# EAGLE design aasdasd (EAGLE 9.0.1)
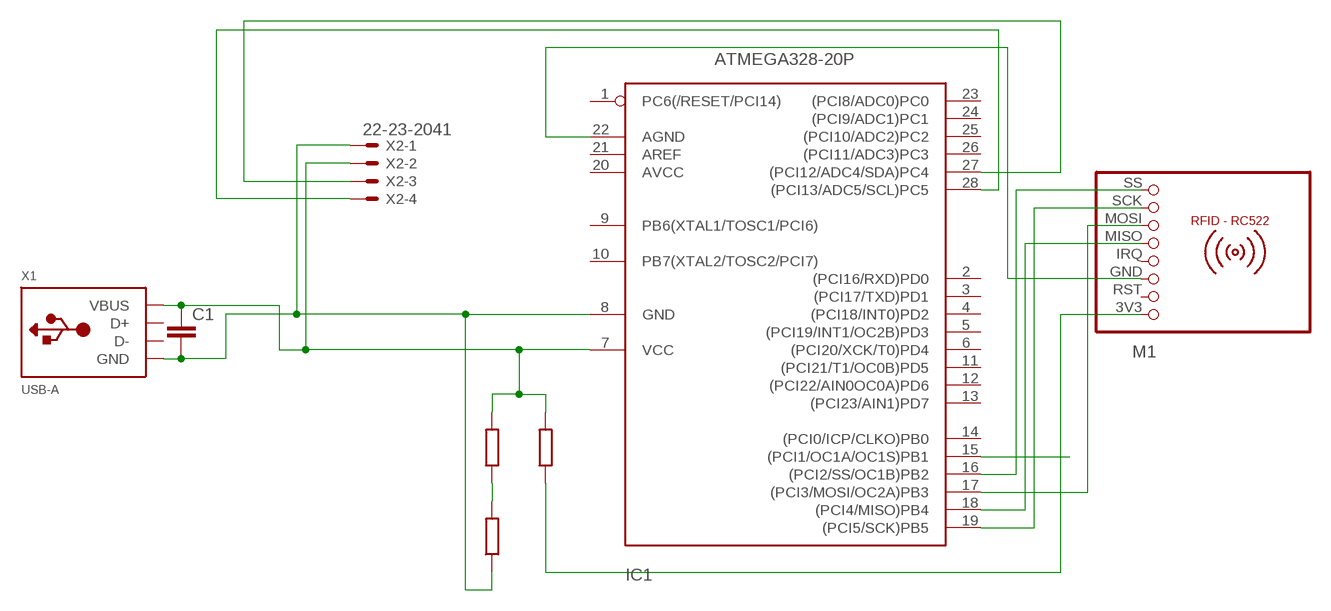
[diagram p0: schematic, sheet 1]

## Parts
C1  C-EU025-050X050  [C025-050X050]
IC1  ATMEGA328-20P  [DIL28-3]
M1  RFID-RC522  [RFID-RC522]
X1  USB-A  [MOLEX_480371000]
X2  22-23-2041  [22-23-2041]

## Nets
N$2: C1.2 IC1.8(GND) X1.4(GND) X2.1
N$3: M1.3V3
N$4: IC1.19((PCI5/SCK)PB5) M1.SCK
N$5: IC1.18((PCI4/MISO)PB4) M1.MISO
N$7: IC1.22(AGND) M1.GND
N$8: IC1.16((PCI2/SS/OC1B)PB2) M1.SS
N$9: IC1.17((PCI3/MOSI/OC2A)PB3) M1.MOSI
N$10: IC1.15((PCI1/OC1A/OC1S)PB1)
N$12: IC1.27((PCI12/ADC4/SDA)PC4) X2.3
N$13: IC1.28((PCI13/ADC5/SCL)PC5) X2.4
N$14: C1.1 IC1.7(VCC) X1.1(VBUS) X2.2
Unconnected: IC1.1(PC6(/RESET/PCI14)) IC1.2((PCI16/RXD)PD0) IC1.3((PCI17/TXD)PD1) IC1.4((PCI18/INT0)PD2) IC1.5((PCI19/INT1/OC2B)PD3) IC1.6((PCI20/XCK/T0)PD4) IC1.9(PB6(XTAL1/TOSC1/PCI6)) IC1.10(PB7(XTAL2/TOSC2/PCI7)) IC1.11((PCI21/T1/OC0B)PD5) IC1.12((PCI22/AIN0OC0A)PD6) IC1.13((PCI23/AIN1)PD7) IC1.14((PCI0/ICP/CLKO)PB0) IC1.20(AVCC) IC1.21(AREF) IC1.23((PCI8/ADC0)PC0) IC1.24((PCI9/ADC1)PC1) IC1.25((PCI10/ADC2)PC2) IC1.26((PCI11/ADC3)PC3) M1.IRQ M1.RST X1.2(D-) X1.3(D+)

## Library data of the parts
C1 = rcl:C-EU: CAPACITOR, European symbol; SPICEPREFIX: C
IC1 = atmega328:ATMEGA328*P: MICROCONTROLLER 32 kBytes FLASH 2 kBytes SRAM 1 kBytes EEPROM USART 8-channel 10 bit ADC
M1 = mfrc522-module:RFID-RC522: RFID-RC522 MFRC-522 based breakout board
X1 = adafruit:USB-A: USB type A 'plug' Used for things that can directly connect to a USB port, say USB key
X2 = con-molex:22-23-2041: .100" (2.54mm) Center Header - 4 Pin; MF: MOLEX; MPN: 22-23-2041; OC_FARNELL: 1462920; OC_NEWARK: 38C0355

## Board
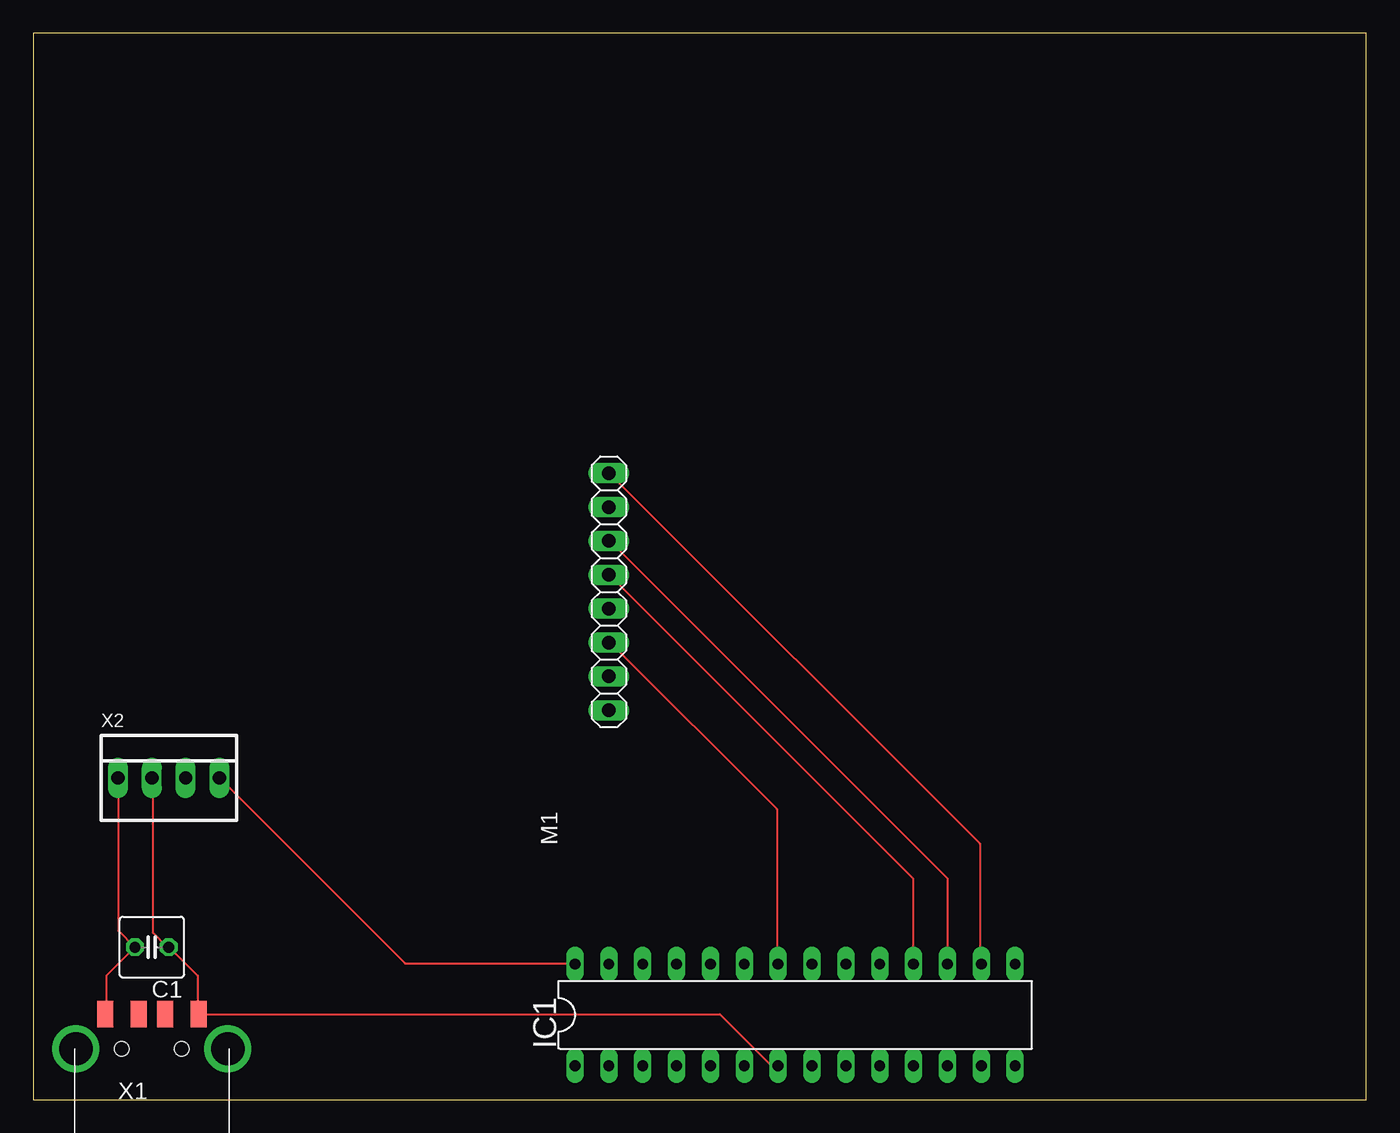
[diagram p1: board, top side]
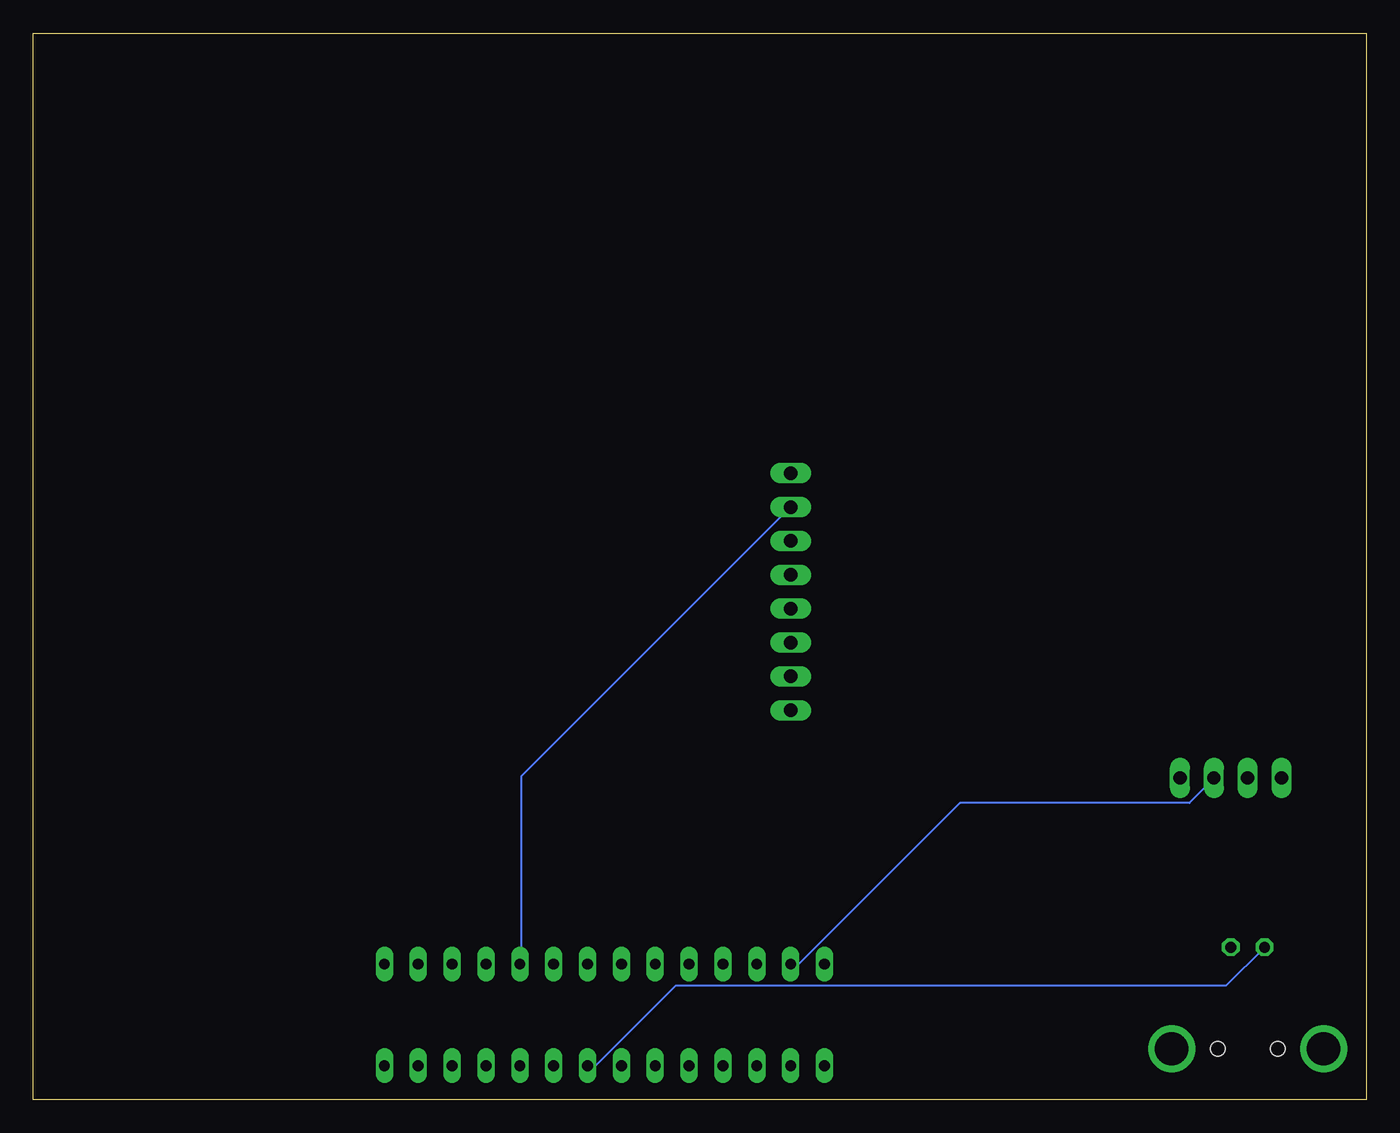
[diagram p2: board, bottom side, seen from below]

Size 100 x 80 mm. Coordinates in mm from the lower left corner, seen from the top.
Outline: 0,0 100,0 100,80 0,80 0,0
Copper layers (1*16): Top 0.035mm / dielectric 1.5mm / Bottom 0.035mm
Design rules "default": minimum track width 6mil, minimum drill 0.35mm, track to track 6mil, track to pad 6mil, pad to pad 6mil, via to via 6mil, smd to smd 6mil, copper to edge 40mil, drill to drill 6mil, minimum pad ring 10mil, minimum via ring 8mil, stop-mask expansion 4mil, vias tented up to drill 0mil, thermal gap 10mil

### Footprints (pad centres in the part's own frame; a part is rotated, then mirrored left to right if it is on the bottom)
C025-050X050 = drill 0.813 octagon: 1 -1.27,0; 2 1.27,0
DIL28-3 = drill 0.813 long: 1 -16.51,-3.81; 2 -13.97,-3.81; 3 -11.43,-3.81; 4 -8.89,-3.81; 5 -6.35,-3.81; 6 -3.81,-3.81; 7 -1.27,-3.81; 8 1.27,-3.81; 9 3.81,-3.81; 10 6.35,-3.81; 11 8.89,-3.81; 12 11.43,-3.81; 13 13.97,-3.81; 14 16.51,-3.81; 15 16.51,3.81; 16 13.97,3.81; 17 11.43,3.81; 18 8.89,3.81; 19 6.35,3.81; 20 3.81,3.81; 21 1.27,3.81; 22 -1.27,3.81; 23 -3.81,3.81; 24 -6.35,3.81; 25 -8.89,3.81; 26 -11.43,3.81; 27 -13.97,3.81; 28 -16.51,3.81
RFID-RC522 = drill 1.016 long: 3V3 -8.89,0; GND -3.81,0; IRQ -1.27,0; MISO 1.27,0; MOSI 3.81,0; RST -6.35,0; SCK 6.35,0; SS 8.89,0
MOLEX_480371000 = smd 1.2 x 2: 1 3.5,2.6; 2 1,2.6; 3 -1,2.6; 4 -3.5,2.6 | drill 2.5: M1 -5.7,0; M2 5.7,0 | hole 1.1: -2.25,0; 2.25,0
22-23-2041 = drill 1 long: 1 -3.81,0; 2 -1.27,0; 3 1.27,0; 4 3.81,0

### Placement (x,y rotation side)
C1  8.89,11.43 180 top
IC1  57.15,6.35 0 top
M1  43.18,38.1 90 top
X1  8.89,3.81 0 top
X2  10.16,24.13 0 top

### Tracks (layer width: path | path; a pad name or v marks a point on that pad's centre or on a via)
N$2
  Top 0.152: X1.4 5.49,6.55 5.49,9.3 C1.2 6.4,12.65 6.4,24.08 X2.1
  Bottom 0.152: C1.2 10.52,8.53 51.82,8.53 57.76,2.59 58.37,2.59 IC1.8
N$4
  Bottom 0.152: M1.SCK 63.4,24.23 63.4,10.21 IC1.19
N$5
  Top 0.152: IC1.18 65.99,10.21 65.99,16.61 43.28,39.32 M1.MISO
N$7
  Top 0.152: IC1.22 55.78,10.21 55.78,21.79 43.28,34.29 M1.GND
N$8
  Top 0.152: IC1.16 71.02,10.21 71.02,19.2 43.28,46.94 M1.SS
N$9
  Top 0.152: IC1.17 68.58,16.61 43.28,41.91 M1.MOSI
N$12
  Bottom 0.152: IC1.27 43.13,10.21 42.52,10.21 30.48,22.25 13.26,22.25 11.43,24.08 X2.3
N$13
  Top 0.152: X2.4 27.89,10.21 40.54,10.21 IC1.28
N$14
  Top 0.152: IC1.7 55.78,2.59 55.32,2.59 51.51,6.4 12.5,6.4 X1.1 12.34,6.55 12.34,9.3 10.21,11.43 C1.1 10.06,11.43 8.99,12.5 8.99,24.08 X2.2